# EAGLE design uart_izol (EAGLE 9.6.2)
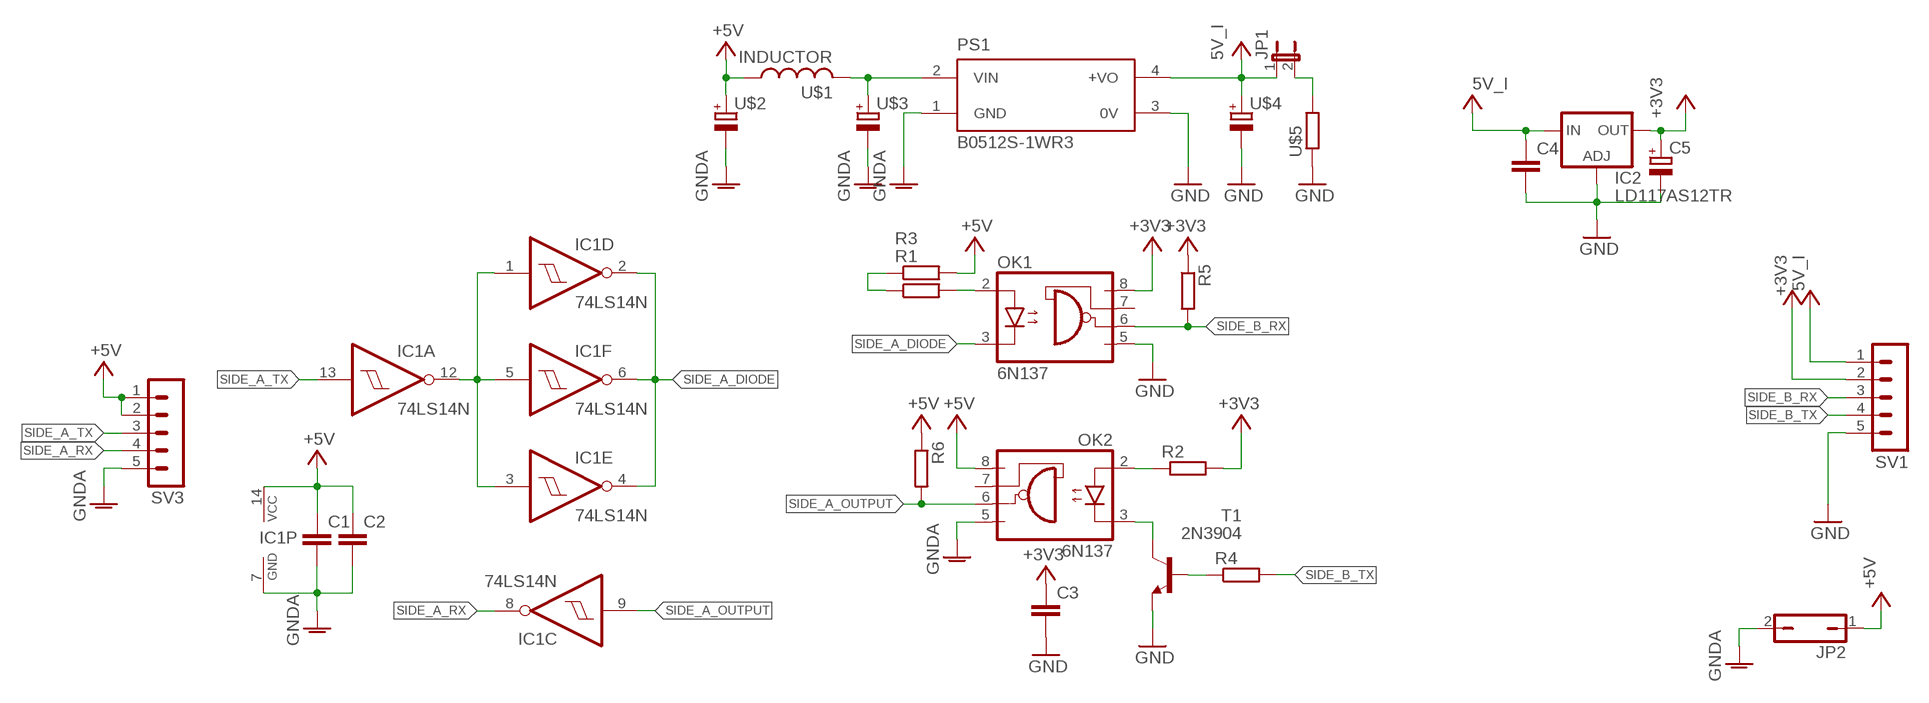
[diagram p0: schematic, sheet 1]

## Parts
C1  C-EUC0805  [C0805]
C2  C-EUC0805  [C0805]
C3  C-EUC0805  [C0805]
C4  C-EUC0805  [C0805]
C5  CPOL-EUSMCB  [SMC_B]
IC1  74LS14N  [DIL14]
IC2  LD117AS12TR  [SOT223]
JP1  JP1E  [JP1]
JP2  JP1Q  [JP1]
OK1  6N137  [DIL08]
OK2  6N137  [DIL08]
PS1  B0512S-1WR3  [CONV_B0512S-1WR3]
R1  R-EU_M0805  [M0805]
R2  R-EU_M0805  [M0805]
R3  R-EU_M0805  [M0805]
R4  R-EU_M0805  [M0805]
R5  R-EU_M0805  [M0805]
R6  R-EU_M0805  [M0805]
SV1  MA05-1  [MA05-1]
SV3  MA05-1  [MA05-1]
T1  2N3904  [TO92]
U$1  INDUCTOR  [0207/10]
U$2  CAPACITOR  [E2,5-7]
U$3  CAPACITOR  [E2,5-7]
U$4  CAPACITOR  [E2,5-7]
U$5  RESISTOR  [0207/10]

## Nets
+3V3: C3.1 C5.+ IC2.4(OUT) OK1.8(VCC) R2.2 R5.1 SV1.2
+5V: C1.1 C2.1 IC1.14(P:VCC) JP2.1 OK2.8(VCC) R3.2 R6.1 SV3.1 SV3.2 U$1.1 U$2.+
GND: C3.2 C4.2 C5.- IC2.1(ADJ) OK1.5(GND) PS1.3(0V) SV1.5 T1.3(E) U$4.- U$5.1
GNDA: C1.2 C2.2 IC1.7(P:GND) JP2.2 OK2.5(GND) PS1.1(GND) SV3.5 U$2.- U$3.-
N$1: OK1.2(A) R1.2
N$2: OK2.2(A) R2.1
N$3: R1.1 R3.1
N$4: OK2.3(C) T1.1(C)
N$5: JP1.2 U$5.2
N$6: R4.1 T1.2(B)
N$7: PS1.2(VIN) U$1.2 U$3.+
N$10: IC1.1(D:I) IC1.3(E:I) IC1.5(F:I) IC1.12(A:O)
SIDE_A_DIODE: IC1.2(D:O) IC1.4(E:O) IC1.6(F:O) OK1.3(C)
SIDE_A_OUTPUT: IC1.9(C:I) OK2.6(VO) R6.2
SIDE_A_RX: IC1.8(C:O) SV3.4
SIDE_A_TX: IC1.13(A:I) SV3.3
SIDE_B_RX: OK1.6(VO) R5.2 SV1.3
SIDE_B_TX: R4.2 SV1.4
VCC: C4.1 IC2.3(IN) JP1.1 PS1.4(+VO) SV1.1 U$4.+ ; supply symbol labelled 5V_I
Unconnected: IC1.10(B:O) IC1.11(B:I) OK1.7(VE) OK2.7(VE)

## Library data of the parts
C1-C4 = rcl:C-EU: CAPACITOR, European symbol; SPICEPREFIX: C
C5 = rcl:CPOL-EU: POLARIZED CAPACITOR, European symbol; SPICEPREFIX: C
IC1 = 74xx-eu:74*14: Hex schmitt trigger INVERTER
IC2 = v-reg:LD117A?*: Low drop fixed and adjustable positive voltage regulators 1 A Source: http://www.st.com/stonline/products/literature/ds/7194/ld1117axx.pdf
JP1 = jumper:JP1E: JUMPER
JP2 = jumper:JP1Q: JUMPER
OK1 OK2 = optocoupler:6N137: MOTOROLA OPTO COUPLER; MPN: 6N137; OC_FARNELL: 1328376; OC_NEWARK: 52M1895
PS1 = for_hommade_printing:B0512S-1WR3: DC/DC Converter Check availability <https://pricing.snapeda.com/parts/B0512S-1WR3/Mornsun%20America%2C%20LLC/view-part?ref=eda>; AVAILABILITY: In Stock; DESCRIPTION: Isolated Module DC DC Converter 1 Output 12V - - - 84mA 4.5V - 5.5V Input; MF: Mornsun America, LLC; MP: B0512S-1WR3; PACKAGE: SIP-4-4 MORNSUN; PRICE: None; PURCHASE-URL: https://pricing.snapeda.com/search/part/B0512S-1WR3/?ref=eda
R1-R6 = rcl:R-EU_: RESISTOR, European symbol; SPICEPREFIX: R
SV1 SV3 = con-lstb:MA05-1: PIN HEADER; OC_FARNELL: unknown; OC_NEWARK: unknown
T1 = transistor:2N3904: NPN TRANSISTOR
U$1 = for_hommade_printing:INDUCTOR
U$2-U$4 = for_hommade_printing:CAPACITOR
U$5 = for_hommade_printing:RESISTOR

## Board
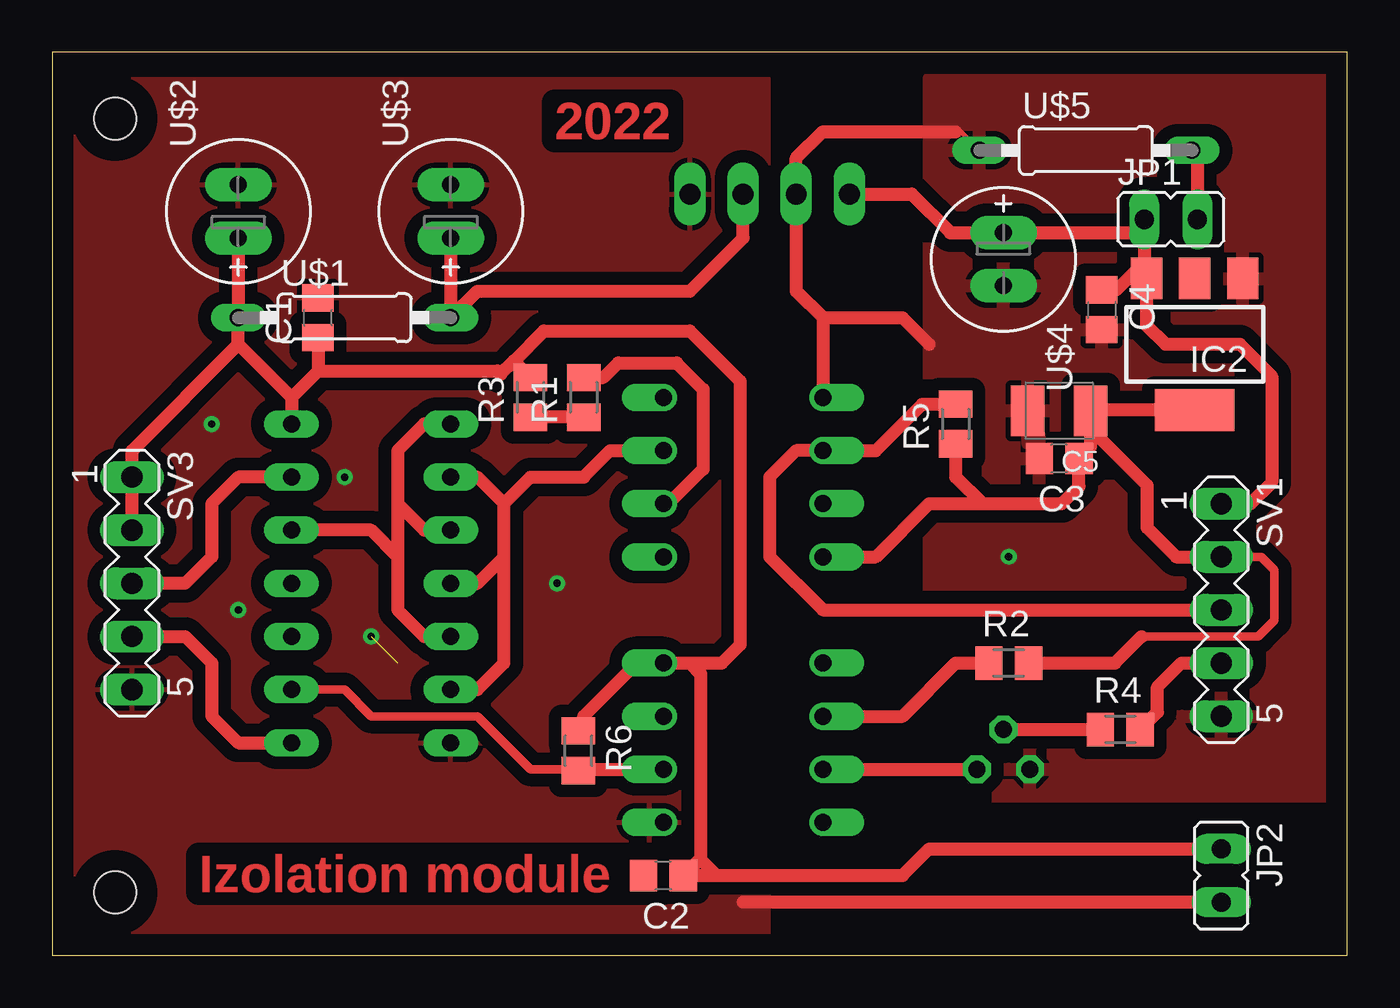
[diagram p1: board, top side]
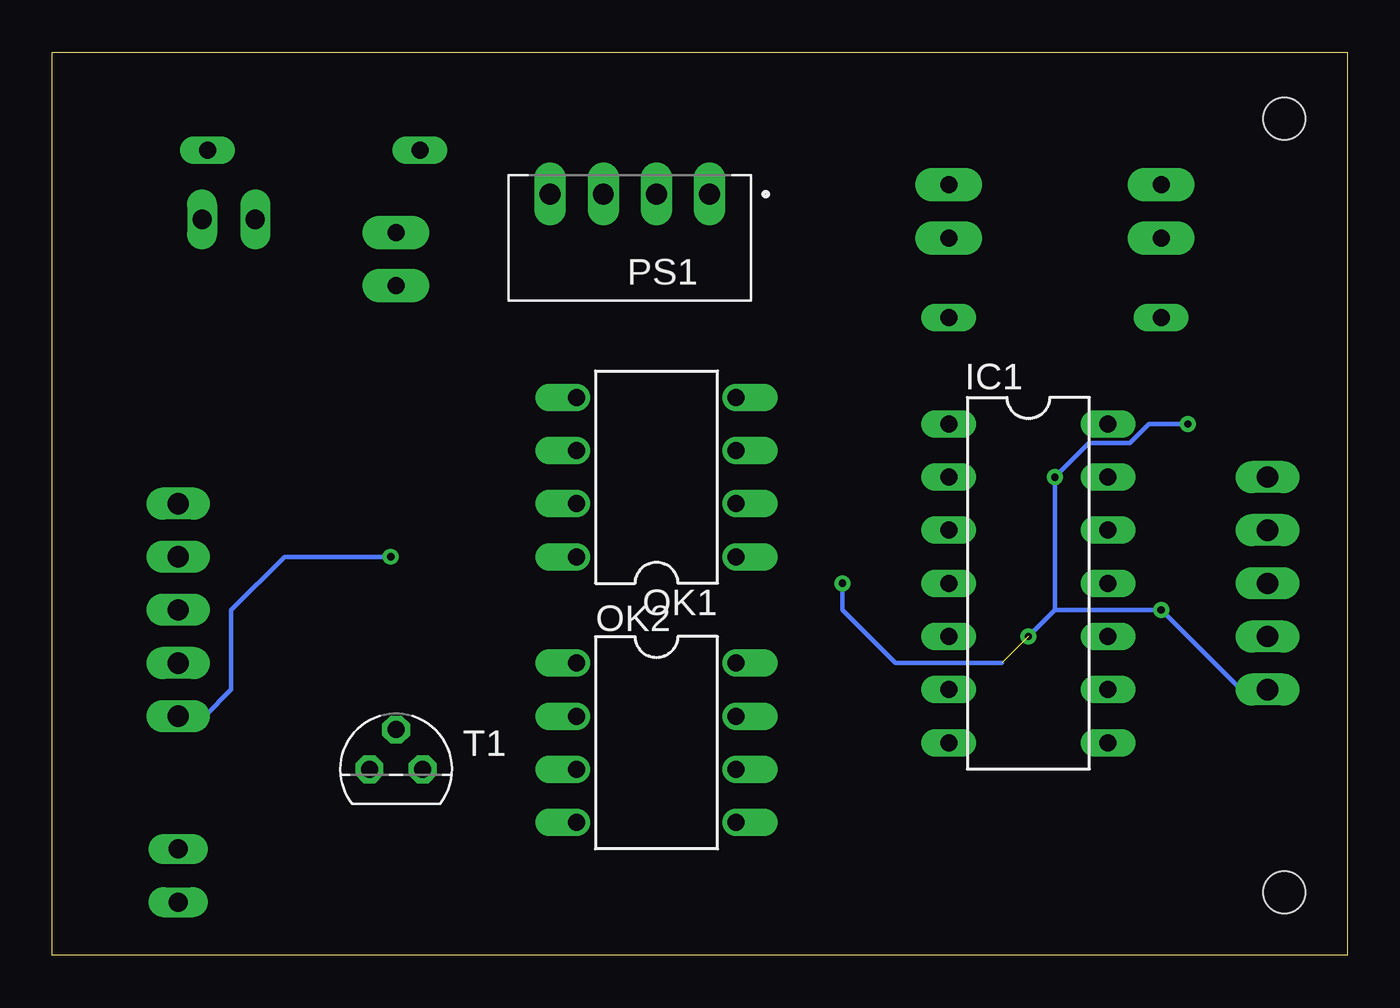
[diagram p2: board, bottom side, seen from below]

Size 61.9 x 43.17 mm. Coordinates in mm from the lower left corner, seen from the top.
Outline: 0,0 61.9,0 61.9,43.17 0,43.17 0,0
Copper layers (1*16): Top 0.035mm / dielectric 1.5mm / Bottom 0.035mm
Design rules "default": minimum track width 6mil, minimum drill 0.35mm, track to track 6mil, track to pad 6mil, pad to pad 6mil, via to via 6mil, smd to smd 6mil, copper to edge 40mil, drill to drill 6mil, minimum pad ring 10mil, minimum via ring 8mil, stop-mask expansion 4mil, vias tented up to drill 0mil, thermal gap 10mil
Holes 2 mm at 3,40 3,3

### Footprints (pad centres in the part's own frame; a part is rotated, then mirrored left to right if it is on the bottom)
C0805 = smd 1.3 x 1.5: 1 -0.95,0; 2 0.95,0
SMC_B = smd 1.6 x 2.4: + -1.5,0; - 1.5,0
DIL14 = drill 0.813 long: 1 -7.62,-3.81; 2 -5.08,-3.81; 3 -2.54,-3.81; 4 0,-3.81; 5 2.54,-3.81; 6 5.08,-3.81; 7 7.62,-3.81; 8 7.62,3.81; 9 5.08,3.81; 10 2.54,3.81; 11 0,3.81; 12 -2.54,3.81; 13 -5.08,3.81; 14 -7.62,3.81
SOT223 = smd 1.5 x 2: 1 -2.3,-3.15; 2 0,-3.15; 3 2.3,-3.15 | smd 3.8 x 2: 4 0,3.15
JP1 = drill 0.914 long: 1 0,-1.27; 2 0,1.27
DIL08 = drill 0.813 offset: 1 -3.81,-3.81; 2 -1.27,-3.81; 3 1.27,-3.81; 4 3.81,-3.81; 5 3.81,3.81; 6 1.27,3.81; 7 -1.27,3.81; 8 -3.81,3.81
CONV_B0512S-1WR3 = drill 1 long: 1 -3.81,-2.1; 2 -1.27,-2.1; 3 1.27,-2.1; 4 3.81,-2.1
M0805 = smd 1.3 x 1.6: 1 -0.95,0; 2 0.95,0
MA05-1 = drill 1.016 long: 1 -5.08,0; 2 -2.54,0; 3 0,0; 4 2.54,0; 5 5.08,0
TO92 = drill 0.813 octagon: 1 1.27,0; 2 0,1.905; 3 -1.27,0
0207/10 = drill 0.813 long: 1 -5.08,0; 2 5.08,0
E2,5-7 = drill 0.813 pad 1.6 long: + -1.27,0; - 1.27,0

### Placement (x,y rotation side)
C1  12.7,30.48 90 top
C2  29.21,3.81 180 top
C3  48.13,23.75 180 top
C4  50.16,30.86 270 top
C5  48.13,26.04 180 top
IC1  15.24,17.78 270 bottom
IC2  54.61,29.21 180 top
JP1  53.47,35.18 270 top
JP2  55.88,3.81 180 top
OK1  33.02,22.86 90 bottom
OK2  33.02,10.16 270 bottom
PS1  34.29,34.29 180 bottom
R1  25.4,26.67 90 top
R2  45.72,13.97 0 top
R3  22.86,26.67 90 top
R4  51.05,10.79 0 top
R5  43.18,25.4 90 top
R6  25.15,9.78 270 top
SV1  55.88,16.51 270 top
SV3  3.81,17.78 270 top
T1  45.47,8.89 0 bottom
U$1  13.97,30.48 0 top
U$2  8.89,35.56 90 top
U$3  19.05,35.56 90 top
U$4  45.47,33.27 270 top
U$5  49.4,38.48 0 top

### Tracks (layer width: path | path; a pad name or v marks a point on that pad's centre or on a via)
+3V3
  Top 0.406: SV1.2 57.78,19.05 58.42,18.41 58.42,16 57.66,15.24 52.07,15.24
  Top 0.61: 54.59,25.38 54.59,26.04 IC2.4 | 53.34,25.4 54.61,26.67 IC2.4 | IC2.4 49.66,26.06 C5.+ | C5.+ 49.63,24.3 C3.1 49.08,22.41 48.26,21.59 44.45,21.59 | OK1.8 39.37,19.05 41.91,21.59 44.45,21.59 | R5.1 43.18,22.86 44.45,21.59 | C5.+ 49.63,25.17 52.32,22.48 52.32,20.45 53.72,19.05 SV1.2 | 52.07,15.24 50.8,13.97 R2.2
+5V
  Top 0.61: 8.89,29.21 11.43,26.67 | 11.43,26.67 IC1.14 | 11.43,26.67 12.7,27.94 | 22.07,28.41 R3.2 | 12.7,27.94 21.27,27.94 21.43,27.78 22.07,28.41 | 22.07,28.41 23.5,29.84 30.48,29.84 32.89,27.43 32.89,14.86 32,13.97 30.48,13.97 | R6.1 25.4,10.98 25.4,11.43 27.94,13.97 OK2.8 30.48,13.97 | SV3.2 SV3.1 3.81,24.13 8.89,29.21 | 8.89,29.21 U$1.1 U$2.+ | C1.1 12.7,27.94 | JP2.1 41.91,5.08 40.64,3.81 31.75,3.81 | 30.48,13.97 30.99,13.46 30.99,4.64 30.95,4.61 | 30.95,4.61 C2.1 31.75,3.81 | 30.95,4.61 31.75,3.81
GND  (via drill 0.35)
  Top 0.203: 43,39.37 43.43,39.37 U$5.1
  Top 0.61: 36.83,30.48 35.56,31.75 PS1.3 35.56,38.1 36.83,39.37 43,39.37 43.18,39.37 | 36.83,30.48 OK1.5 | 36.83,30.48 40.64,30.48 41.91,29.21
  Bottom 0.203: v45.72,19.05 50.8,19.05 53.34,16.51 53.34,12.7 54.61,11.43 SV1.5
  pour Top (isolate 0.61): 41.91,41.91 41.91,7.62 60.96,7.62 60.96,41.91
GNDA  (via drill 0.35)  (1 unrouted)
  Top 0.61: 55.55,2.21 JP2.2 33.02,2.54
  Bottom 0.203: SV3.5 5.08,12.7 v8.89,16.51 13.97,16.51 | v15.24,15.24 13.97,16.51 | v24.13,17.78 24.13,16.51 21.59,13.97 16.51,13.97 | 13.97,16.51 v13.97,22.86 12.34,24.49 10.39,24.49 9.48,25.4 v7.62,25.4
  pour Top (isolate 0.61): 0,41.91 0,0 34.29,0 34.29,41.91
N$1
  Top 0.61: R1.2 26.35,27.62 27.05,28.32 29.84,28.32 31.11,27.05 31.11,23.24 29.46,21.59 OK1.2
N$2
  Top 0.61: OK2.2 40.64,11.43 43.18,13.97 R2.1
N$3
  Top 0.61: R1.1 R3.1
N$4
  Top 0.61: OK2.3 T1.1
N$5
  Top 0.61: U$5.2 54.74,38.23 JP1.2
N$6
  Top 0.61: T1.2 R4.1
N$7
  Top 0.61: U$3.+ U$1.2 20.32,31.75 30.48,31.75 33.02,34.29 PS1.2
N$10
  Top 0.61: IC1.1 17.78,25.4 16.51,24.13 16.51,21.59 | 16.51,21.59 16.51,19.05 | 16.51,19.05 16.51,16.51 17.78,15.24 IC1.5 | 16.51,21.59 17.78,20.32 IC1.3 | 16.51,19.05 15.24,20.32 IC1.12
SIDE_A_DIODE
  Top 0.61: IC1.2 20.32,22.86 21.59,21.59 | 21.59,19.05 21.59,21.59 | 21.59,19.05 21.59,13.97 20.32,12.7 IC1.6 | IC1.4 20.32,17.78 21.59,19.05 | 21.59,21.59 22.86,22.86 25.4,22.86 26.67,24.13 OK1.3
SIDE_A_OUTPUT
  Top 0.406: IC1.9 13.97,12.7 15.24,11.43 20.32,11.43 22.86,8.89 25.21,8.89
  Top 0.61: R6.2 25.21,8.89 OK2.6
SIDE_A_RX
  Top 0.61: SV3.4 6.35,15.24 7.62,13.97 7.62,11.43 8.89,10.16 IC1.8
SIDE_A_TX
  Top 0.61: IC1.13 8.89,22.86 7.62,21.59 7.62,19.05 6.35,17.78 SV3.3
SIDE_B_RX
  Top 0.61: R5.2 41.59,26.35 39.37,24.13 OK1.6 35.56,24.13 34.29,22.86 34.29,19.05 36.83,16.51 SV1.3
SIDE_B_TX
  Top 0.61: R4.2 52.83,11.62 52.83,12.83 53.98,13.97 SV1.4
VCC
  Top 0.61: 52.14,35.12 JP1.1 52.2,34.29 | 52.2,34.29 52.2,32.47 | 52.2,32.47 51.86,32.81 50.86,31.81 C4.1 | 52.2,32.47 IC2.3 52.31,30.11 53.21,29.21 56.77,29.21 58.29,27.69 58.29,22.61 57.28,21.59 SV1.1 | PS1.4 41.08,36.39 42.93,34.54 U$4.+ 51.94,34.54 52.2,34.29

### Text on the board
Top: 2022 | Izolation module